# EAGLE schematic Erika (EAGLE 9.6.2)
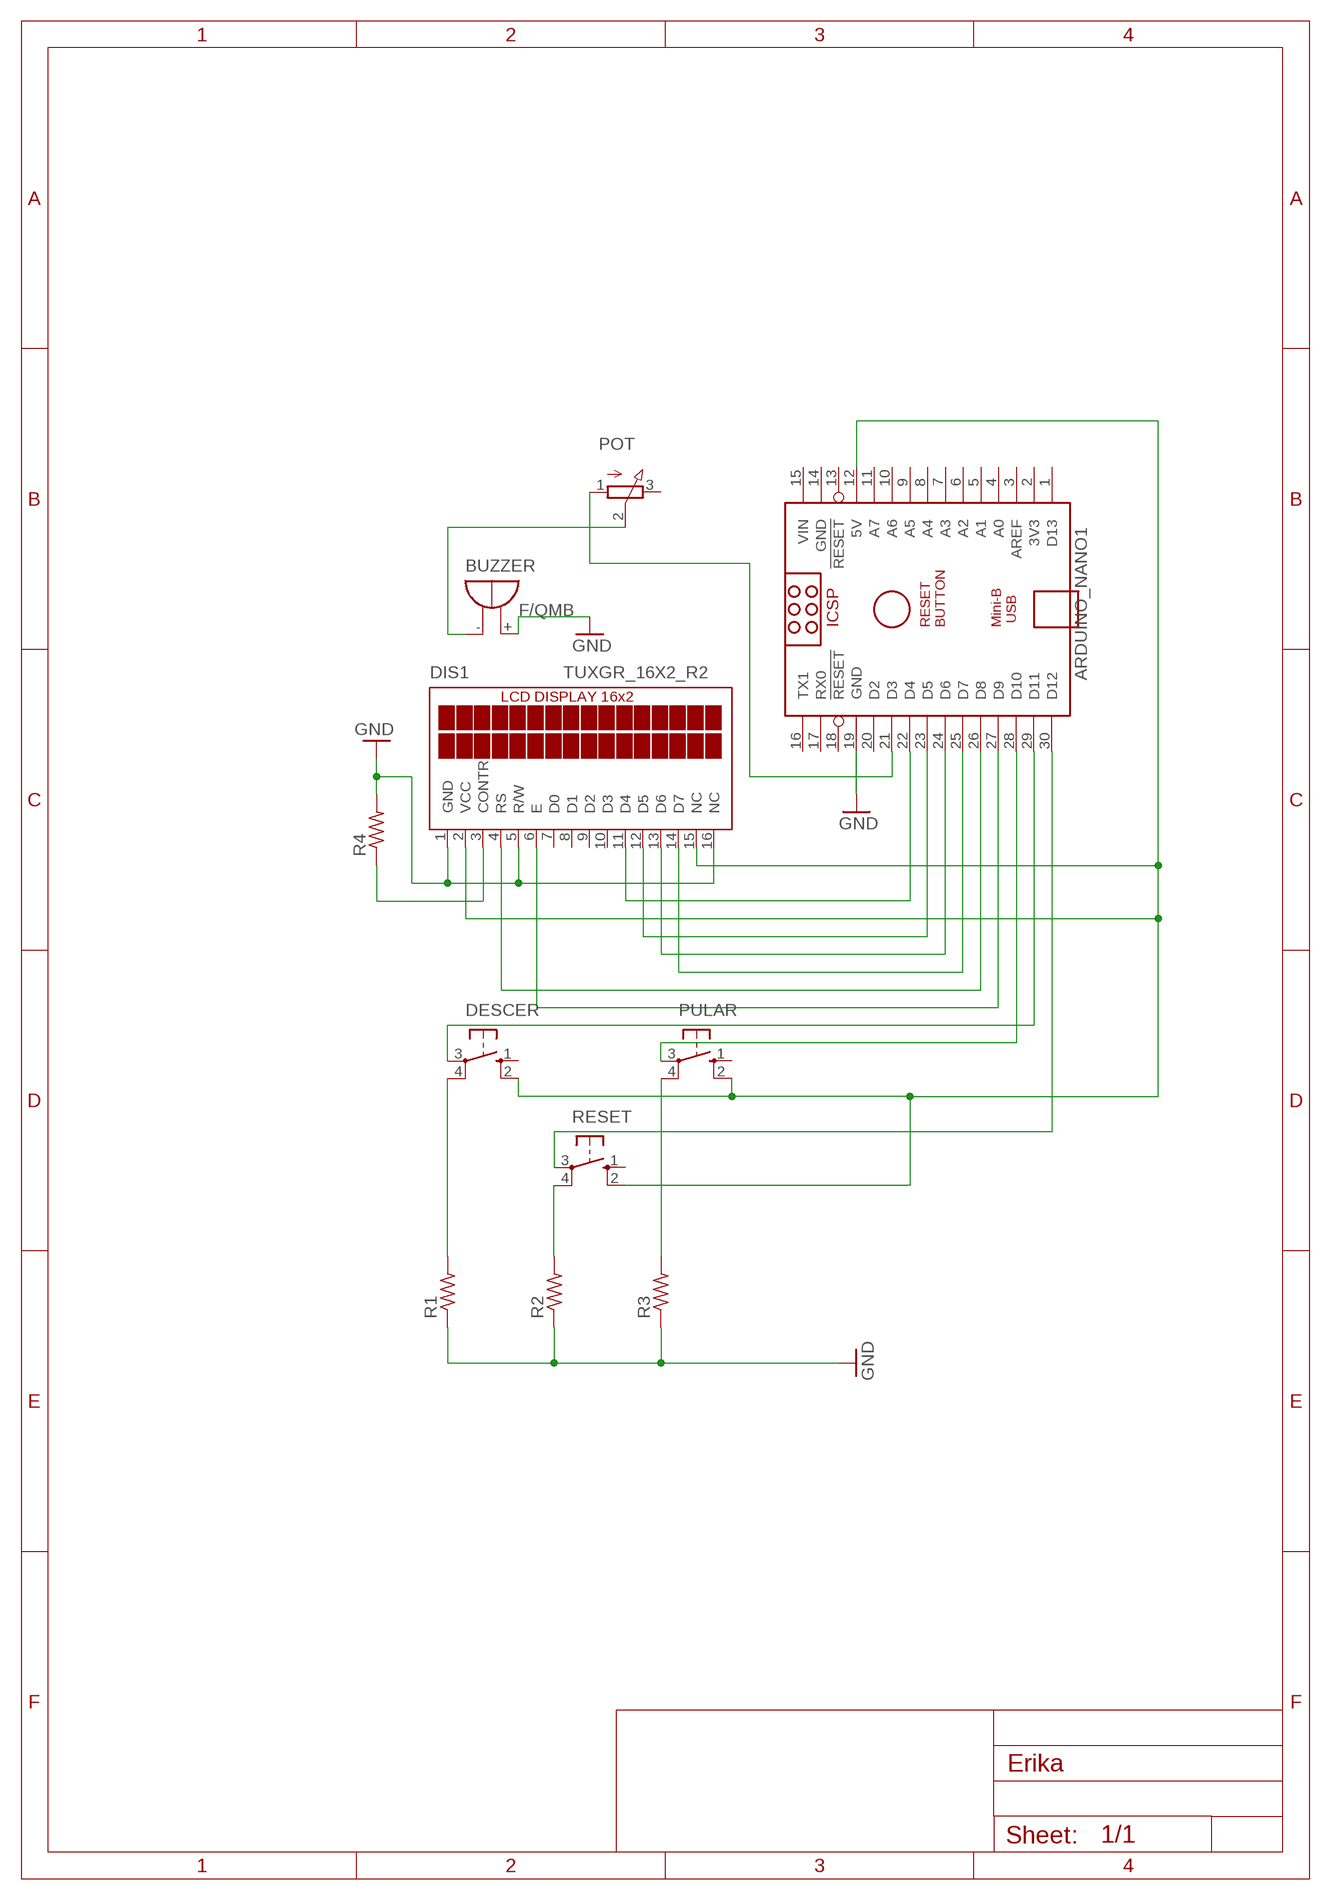
[diagram p0: schematic, sheet 1]

## Parts
ARDUINO_NANO1  ARDUINO_NANO  [ARDUINO_NANO]
BUZZER  F/QMB  [F/QMB]
DESCER  40-XX  [B3F-40XX]
DIS1  TUXGR_16X2_R2  [TUXGR_16X2_R2]
POT  3RP/1610N  [3RP/1610N]
PULAR  40-XX  [B3F-40XX]
R1  R-US_0207/10  [0207/10]
R2  R-US_0207/10  [0207/10]
R3  R-US_0207/10  [0207/10]
R4  R-US_0207/10  [0207/10]
RESET  40-XX  [B3F-40XX]

## Nets
GND [alimentação]: ARDUINO_NANO1.19(GND) BUZZER.+(-) DIS1.1(GND) DIS1.5(R/W) DIS1.16(NC) R1.1 R2.1 R3.1 R4.2
N$1: ARDUINO_NANO1.22(D4) DIS1.11(D4)
N$2: DESCER.4(P1) R1.2
N$3: ARDUINO_NANO1.28(D10) PULAR.3(P)
N$4: ARDUINO_NANO1.29(D11) DESCER.3(P)
N$5: ARDUINO_NANO1.30(D12) RESET.3(P)
N$6: BUZZER.-(+) POT.2(S)
N$7: ARDUINO_NANO1.23(D5) DIS1.12(D5)
N$8: R2.2 RESET.4(P1)
N$10: PULAR.4(P1) R3.2
N$11: DIS1.3(CONTR) R4.1
N$12: ARDUINO_NANO1.24(D6) DIS1.13(D6)
N$13: ARDUINO_NANO1.25(D7) DIS1.14(D7)
N$14: ARDUINO_NANO1.26(D8) DIS1.4(RS)
N$15: ARDUINO_NANO1.27(D9) DIS1.6(E)
N$16: ARDUINO_NANO1.21(D3) POT.1(A)
VCC [alimentação]: ARDUINO_NANO1.12(5V) DESCER.2(S1) DIS1.2(VCC) DIS1.15(NC) PULAR.2(S1) RESET.2(S1)
Unconnected: ARDUINO_NANO1.1(D13) ARDUINO_NANO1.2(3V3) ARDUINO_NANO1.3(AREF) ARDUINO_NANO1.4(A0) ARDUINO_NANO1.5(A1) ARDUINO_NANO1.6(A2) ARDUINO_NANO1.7(A3) ARDUINO_NANO1.8(A4) ARDUINO_NANO1.9(A5) ARDUINO_NANO1.10(A6) ARDUINO_NANO1.11(A7) ARDUINO_NANO1.13(!RESET) ARDUINO_NANO1.16(TX1) ARDUINO_NANO1.17(RX0) ARDUINO_NANO1.18(!RESET) ARDUINO_NANO1.20(D2) DESCER.1(S) DIS1.7(D0) DIS1.8(D1) DIS1.9(D2) DIS1.10(D3) POT.3(E) PULAR.1(S) RESET.1(S)

## Power pins joined to a net without a drawn wire
GND: ARDUINO_NANO1.14(GND)
VIN: ARDUINO_NANO1.15(VIN)

## Library data of the parts
ARDUINO_NANO1 = ArduinoNanoV30:ARDUINO_NANO: Arduino Nano V3.0 Overview: The Arduino Nano is a small, complete, and breadboard-friendly board based on the ATmega328 (Arduino Nano 3.x) or ATmega168 (Arduino Nano 2.x). It has more or less the same functionality of the Arduino Duemilanove, but in a different package. It lacks only a DC power jack, and works with a Mini-B USB cable instead of a standard one. The Nano was designed and is being produced by Gravitech. Specifications: Microcontroller Atmel ATmega168 or ATmega328 Operating Voltage (logic level) 5 V Input Voltage (recommended) 7-12 V Input Voltage (limits) 6-20 V Digital I/O Pins 14 (of which 6 provide PWM output) Analog Input Pins 8 DC Current per I/O Pin 40 mA Flash Memory 16 KB (ATmega168) or 32 KB (ATmega328) of which 2 KB used by bootloader SRAM 1 KB (ATmega168) or 2 KB (ATmega328) EEPROM 512 bytes (ATmega168) or 1 KB (ATmega328) Clock Speed 16 MHz Dimensions 0.73" x 1.70" Length 45 mm Width 18 mm Weigth 5 g Power: The Arduino Nano can be powered via the Mini-B USB connection, 6-20V unregulated external power supply (pin 30), or 5V regulated external power supply (pin 27). The power source is automatically selected to the highest voltage source. Memory: The ATmega168 has 16 KB of flash memory for storing code (of which 2 KB is used for the bootloader); the ATmega328 has 32 KB, (also with 2 KB used for the bootloader). The ATmega168 has 1 KB of SRAM and 512 bytes of EEPROM (which can be read and written with the EEPROM library); the ATmega328 has 2 KB of SRAM and 1 KB of EEPROM. Input and Output: Each of the 14 digital pins on the Nano can be used as an input or output, using pinMode(), digitalWrite(), and digitalRead() functions. They operate at 5 volts. Each pin can provide or receive a maximum of 40 mA and has an internal pull-up resistor (disconnected by default) of 20-50 kOhms. In addition, some pins have specialized functions. Visit Arduino - ArduinoBoardNano <https://www.arduino.cc/en/Main/ArduinoBoardNano>
BUZZER = buzzer:F/QMB: BUZZER Source: Buerklin; OC_FARNELL: unknown; OC_NEWARK: unknown
DESCER PULAR RESET = switch-omron:40-XX: OMRON SWITCH; MF: OMRON COMPONENTS USA; MPN: B3F-4000; OC_FARNELL: 176434; OC_NEWARK: 36K3105
DIS1 = display-lcd:TUXGR_16X2_R2: Tuxgraphics LCD display 16x2 characters reflective, without background light Source: tuxgr_12x2_r2.pdf; OC_FARNELL: unknown; OC_NEWARK: unknown
POT = pot:3RP/1610N: 16mm Potentiometer one level Source: http://www.alphapotentiometers.net/html/16mm_pot_2.html
R1-R4 = rcl:R-US_: RESISTOR, American symbol; SPICEPREFIX: R

## Net classes
0 default: width 0.508 mm
1 alimentação: width 1.016 mm